# EAGLE schematic BrewMonitor-v1.0 (EAGLE 7.0.0)
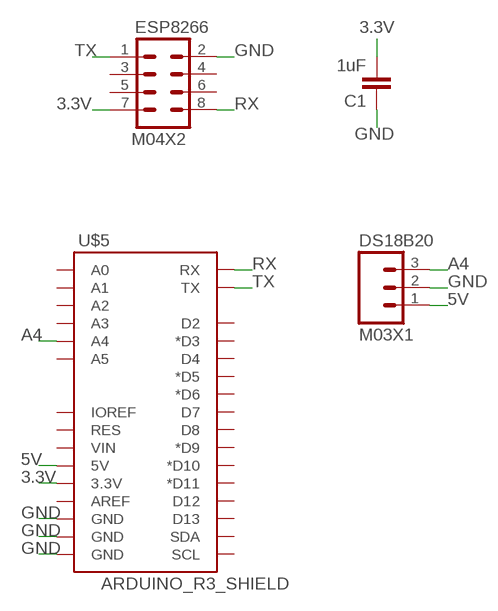
[diagram p0: schematic, sheet 1]

## Parts
C1  1uF  CAPPTH  [CAP-PTH-SMALL]
DS18B20  M03X1  M03SCREW  [SCREWTERMINAL-3.5MM-3]
ESP8266  M04X2  [2X4]
U$5  ARDUINO_R3_SHIELD  [UNO_R3_SHIELD]

## Nets
3.3V: C1.2 ESP8266.7 U$5.3.3V
5V: DS18B20.1 U$5.5V
A4: DS18B20.3 U$5.A4
GND: C1.1 DS18B20.2 ESP8266.2 U$5.GND@0(GND) U$5.GND@1(GND) U$5.GND@2(GND)
RX: ESP8266.8 U$5.RX
TX: ESP8266.1 U$5.TX
Unconnected: ESP8266.3 ESP8266.4 ESP8266.5 ESP8266.6 U$5.A0 U$5.A1 U$5.A2 U$5.A3 U$5.A5 U$5.AREF U$5.D2 U$5.D3(*D3) U$5.D4 U$5.D5(*D5) U$5.D6(*D6) U$5.D7 U$5.D8 U$5.D9(*D9) U$5.D10(*D10) U$5.D11(*D11) U$5.D12 U$5.D13 U$5.IOREF U$5.RES U$5.SCL U$5.SDA U$5.VIN

## Library data of the parts
C1 = SparkFun-Passives:CAP: Capacitor Standard 0603 ceramic capacitor, and 0.1" leaded capacitor.
DS18B20 = SparkFun-Connectors:M03: Header 3 Standard 3-pin 0.1" header. Use with straight break away headers (SKU : PRT-00116), right angle break away headers (PRT-00553), swiss pins (PRT-00743), machine pins (PRT-00117), and female headers (PRT-00115). Molex polarized connector foot print use with SKU : PRT-08232 with associated crimp pins and housings.
ESP8266 = SparkFun-Connectors:M04X2: .1" header, two rows of four.
U$5 = SparkFun-Boards:ARDUINO_R3_SHIELD: Shield form compatible with the Arduino Uno R3.